# Altium schematic sheet usb_c.SchDoc
size A
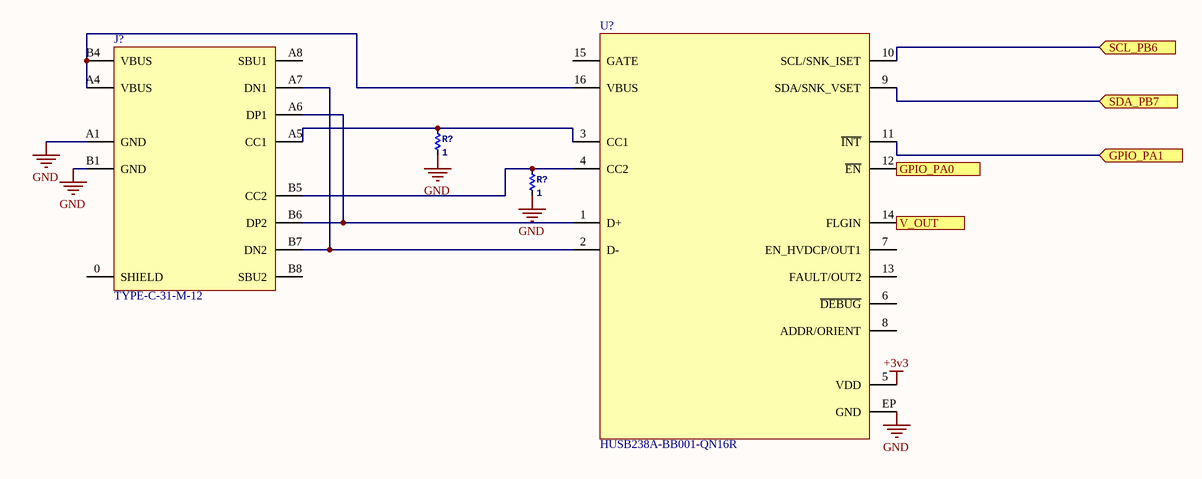
[diagram p0: usb_c.SchDoc]

## Parts
(Parts that share a designator on the sheet are numbered #1, #2 ... from top to bottom, then left to right.)
J?  TYPE-C-31-M-12  [CONN_USBC_TYPE-C-31-M-12]
R?#1  Resistance: 1  [R0402_0.40MM]  (hidden comment: ERJ-2BQF1R0X)
R?#2  Resistance: 1  [R0402_0.40MM]  (hidden comment: ERJ-2BQF1R0X)
U?  HUSB238A-BB001-QN16R  [QFN50P300X300X90-16N]

## Ports
GPIO_PA0 (in), GPIO_PA1 (in), SCL_PB6 (in), SDA_PB7 (in), V_OUT (out)

## Nets
+3v3: U?.5(VDD)
GND: J?.A1(GND) J?.B1(GND) R?#1.1 R?#2.1 U?.EP(GND)
GPIO_PA0: U?.12(~{EN}) ; port GPIO_PA0
GPIO_PA1: U?.11(~{INT}) ; port GPIO_PA1
SCL_PB6: U?.10(SCL/SNK_ISET) ; port SCL_PB6
SDA_PB7: U?.9(SDA/SNK_VSET) ; port SDA_PB7
V_OUT: U?.14(FLGIN) ; port V_OUT
NetJ?_A4: J?.A4(VBUS) J?.B4(VBUS) U?.16(VBUS)
NetJ?_A5: J?.A5(CC1) R?#1.2 U?.3(CC1)
NetJ?_A6: J?.A6(DP1) J?.B6(DP2) U?.1(D+)
NetJ?_A7: J?.A7(DN1) J?.B7(DN2) U?.2(D-)
NetJ?_B5: J?.B5(CC2) R?#2.2 U?.4(CC2)

Not connected (* = marked no-connect by the designer): J? 0(SHIELD) A8(SBU1) B8(SBU2); U? 6(~{DEBUG}) 7(EN_HVDCP/OUT1) 8(ADDR/ORIENT) 13(FAULT/OUT2) 15(GATE)

## Library data of the parts
J? = CONN_USBC_TYPE-C-31-M-12: 5A 1 16P Female Type-C SMD USB Connectors ROHS; Manufacturer: HRO Electronics; ComponentLink1Description: Product page; ComponentLink1URL: https://en.krhro.com/Product-Details/726.html; ComponentLink2Description: Drawing; ComponentLink2URL: https://omo-oss-file.thefastfile.com/portal-saas/new2023011311465142457/cms/file/95f41c83-14fa-41cb-9f86-8d6a717317e5.pdf; Manufacturer Part Number: TYPE-C-31-M-12; Supplier 1: LCSC; Supplier Part Number 1: C165948
R?#1 R?#2 = ERJ-2BQF1R0X: RES SMD 1 OHM 1% 1/6W 0402; Manufacturer: Panasonic Electronic Components; Unit Price (USD): 0.41; Power (Watts): 0.167W, 1/6W; Temperature Coefficient: ±250ppm/°C; ComponentLink1Description: Datasheet; ComponentLink1URL: https://industrial.panasonic.com/cdbs/www-data/pdf/RDN0000/AOA0000C313.pdf; Series: ERJ; Tolerance: ±1%; Composition: Thick Film; Features: Automotive AEC-Q200, Current Sense; Operating Temperature: -55°C ~ 125°C; Package / Case: 0402 (1005 Metric); Supplier Device Package: 0402; Size / Dimension: 0.039" L x 0.020" W (1.00mm x 0.50mm); Height - Seated (Max): 0.016" (0.40mm); Supplier 1: Digikey; Supplier Part Number 1: P17252CT-ND; Manufacturer Part Number: ERJ-2BQF1R0X
U? = USB_PD_HUSB238A: USB PD EPR SINK CONTROLLER WITH I2C; Manufacturer: Hynetek; Supplier 1: LCSC; Supplier Part Number 1: C24833806; Manufacturer Part Number: HUSB238A-BB001-QN16R; ComponentLink1Description: Datasheet; ComponentLink1URL: https://www.lcsc.com/datasheet/lcsc_datasheet_2412301710_Hynetek-HUSB238A-BB001-QN16R_C24833806.pdf; ComponentLink2Description: Product page; ComponentLink2URL: https://en.hynetek.com/2643.html